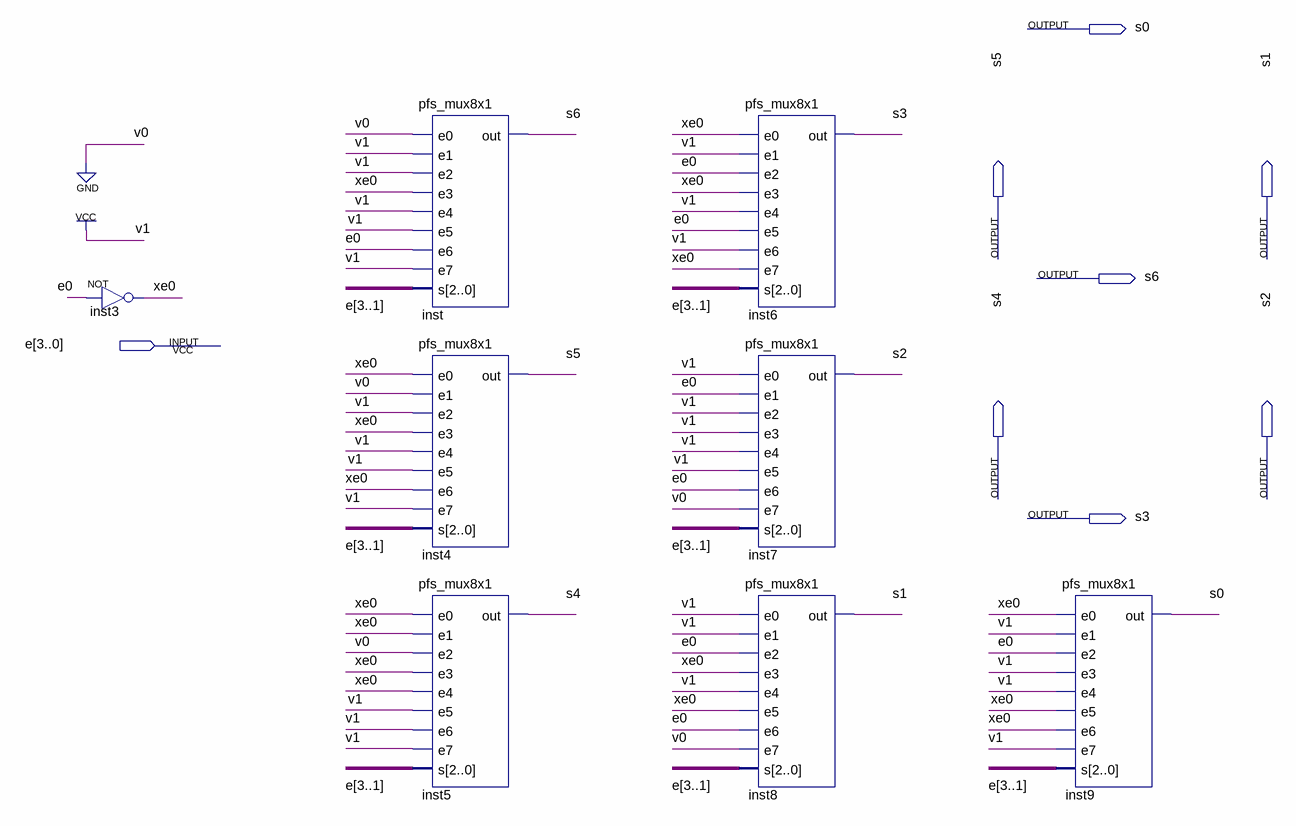
[diagram p0: schematic sheet]
// Quartus schematic pfs_display.bdf as structural Verilog: 8 symbols, 8 pins
module pfs_display (
  input  [3:0] e,
  output s0,
  output s5,
  output s1,
  output s6,
  output s4,
  output s2,
  output s3
);

  wire xe0;

  not inst3 (xe0, e[0]);
  pfs_mux8x1 inst (
    .e0(1'b0), .e1(1'b1), .e2(1'b1), .e3(xe0), .e4(1'b1), .e5(1'b1), .e6(e[0]), .e7(1'b1), .s(e[3:1]),
    .out(s6));
  pfs_mux8x1 inst4 (
    .e0(xe0), .e1(1'b0), .e2(1'b1), .e3(xe0), .e4(1'b1), .e5(1'b1), .e6(xe0), .e7(1'b1), .s(e[3:1]), .out(s5));
  pfs_mux8x1 inst5 (
    .e0(xe0), .e1(xe0), .e2(1'b0), .e3(xe0), .e4(xe0), .e5(1'b1), .e6(1'b1), .e7(1'b1), .s(e[3:1]), .out(s4));
  pfs_mux8x1 inst6 (
    .e0(xe0), .e1(1'b1), .e2(e[0]), .e3(xe0), .e4(1'b1), .e5(e[0]), .e6(1'b1), .e7(xe0), .s(e[3:1]), .out(s3));
  pfs_mux8x1 inst7 (
    .e0(1'b1), .e1(e[0]), .e2(1'b1), .e3(1'b1), .e4(1'b1), .e5(1'b1), .e6(e[0]), .e7(1'b0), .s(e[3:1]),
    .out(s2));
  pfs_mux8x1 inst8 (
    .e0(1'b1), .e1(1'b1), .e2(e[0]), .e3(xe0), .e4(1'b1), .e5(xe0), .e6(e[0]), .e7(1'b0), .s(e[3:1]), .out(s1));
  pfs_mux8x1 inst9 (
    .e0(xe0), .e1(1'b1), .e2(e[0]), .e3(1'b1), .e4(1'b1), .e5(xe0), .e6(xe0), .e7(1'b1), .s(e[3:1]), .out(s0));
endmodule
